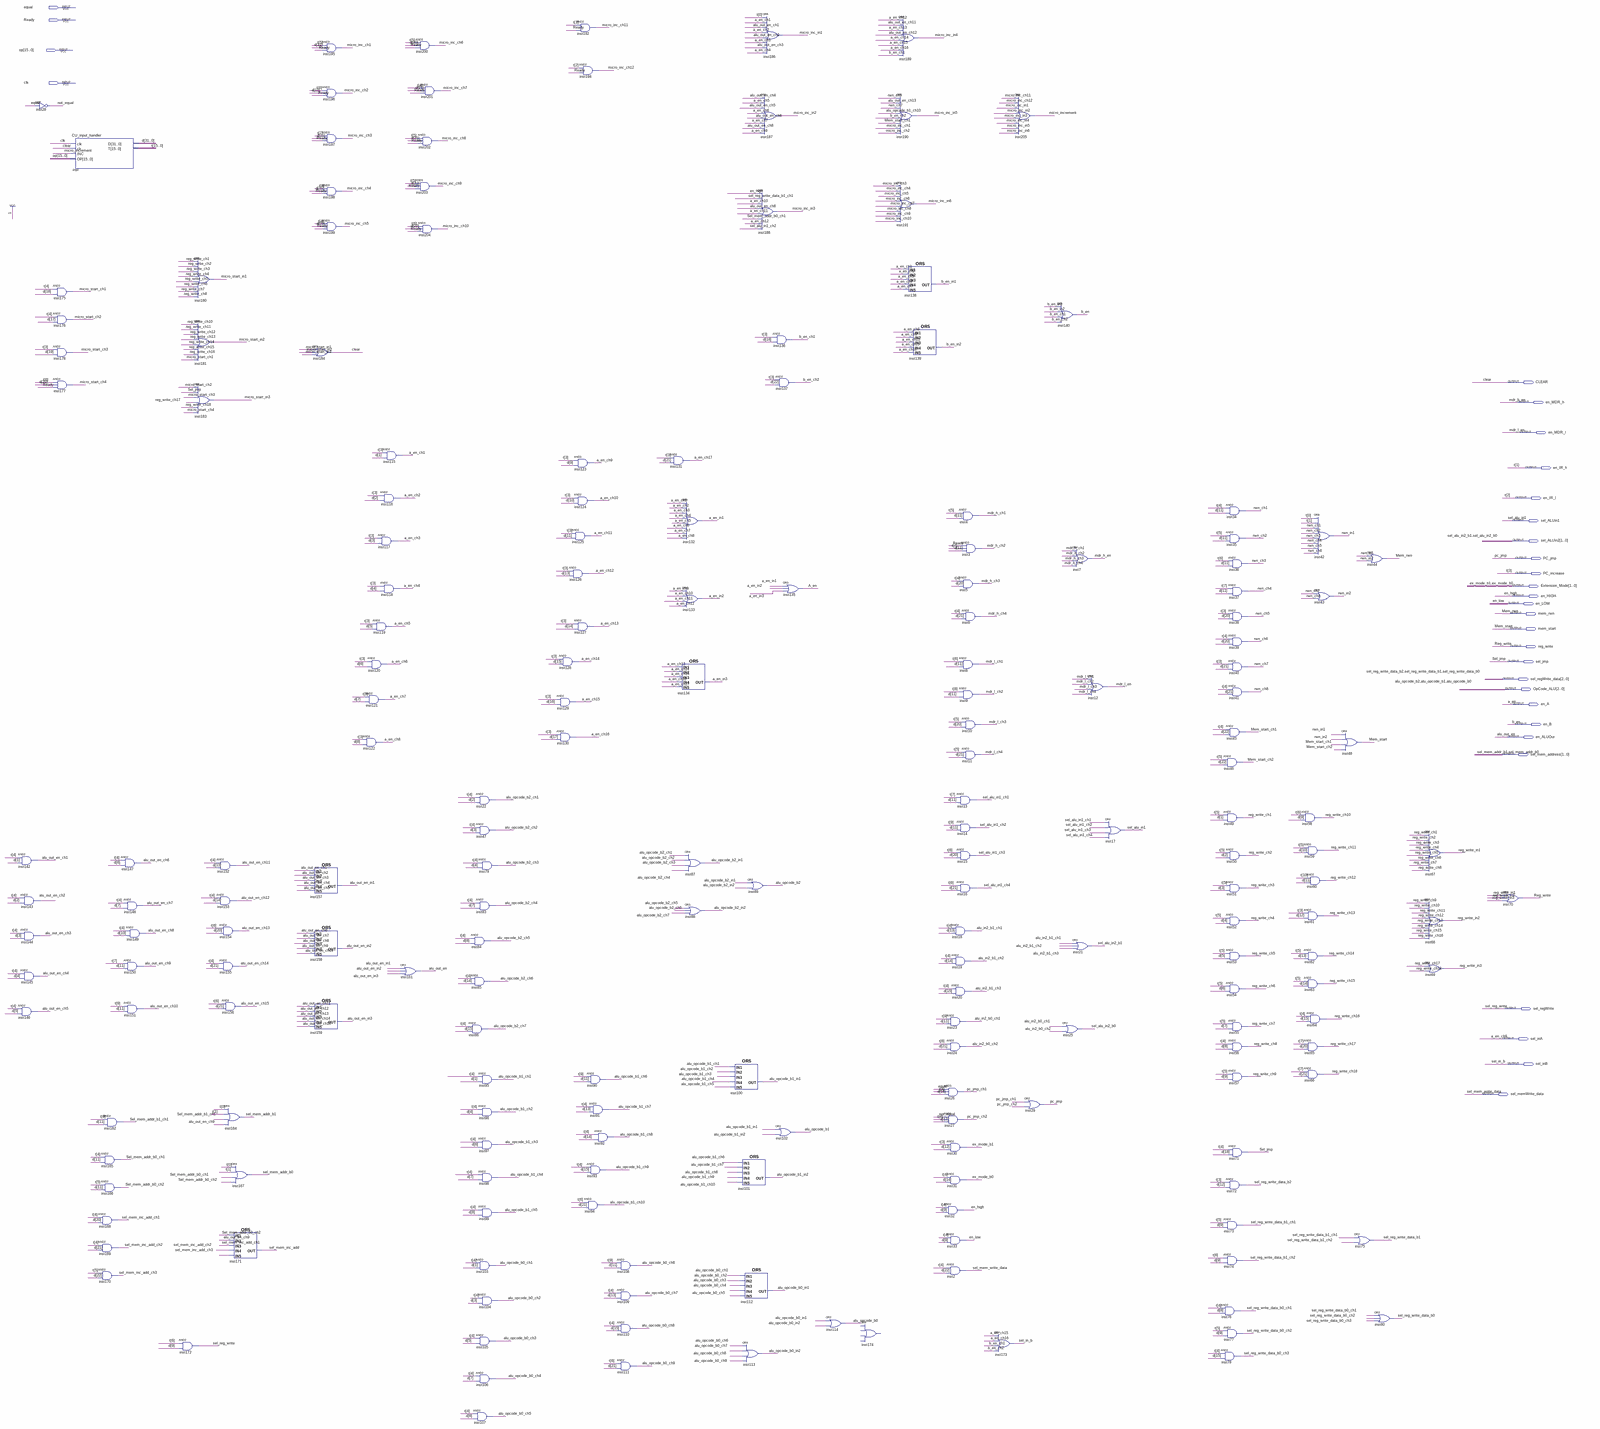
[diagram p0: schematic sheet, whole]
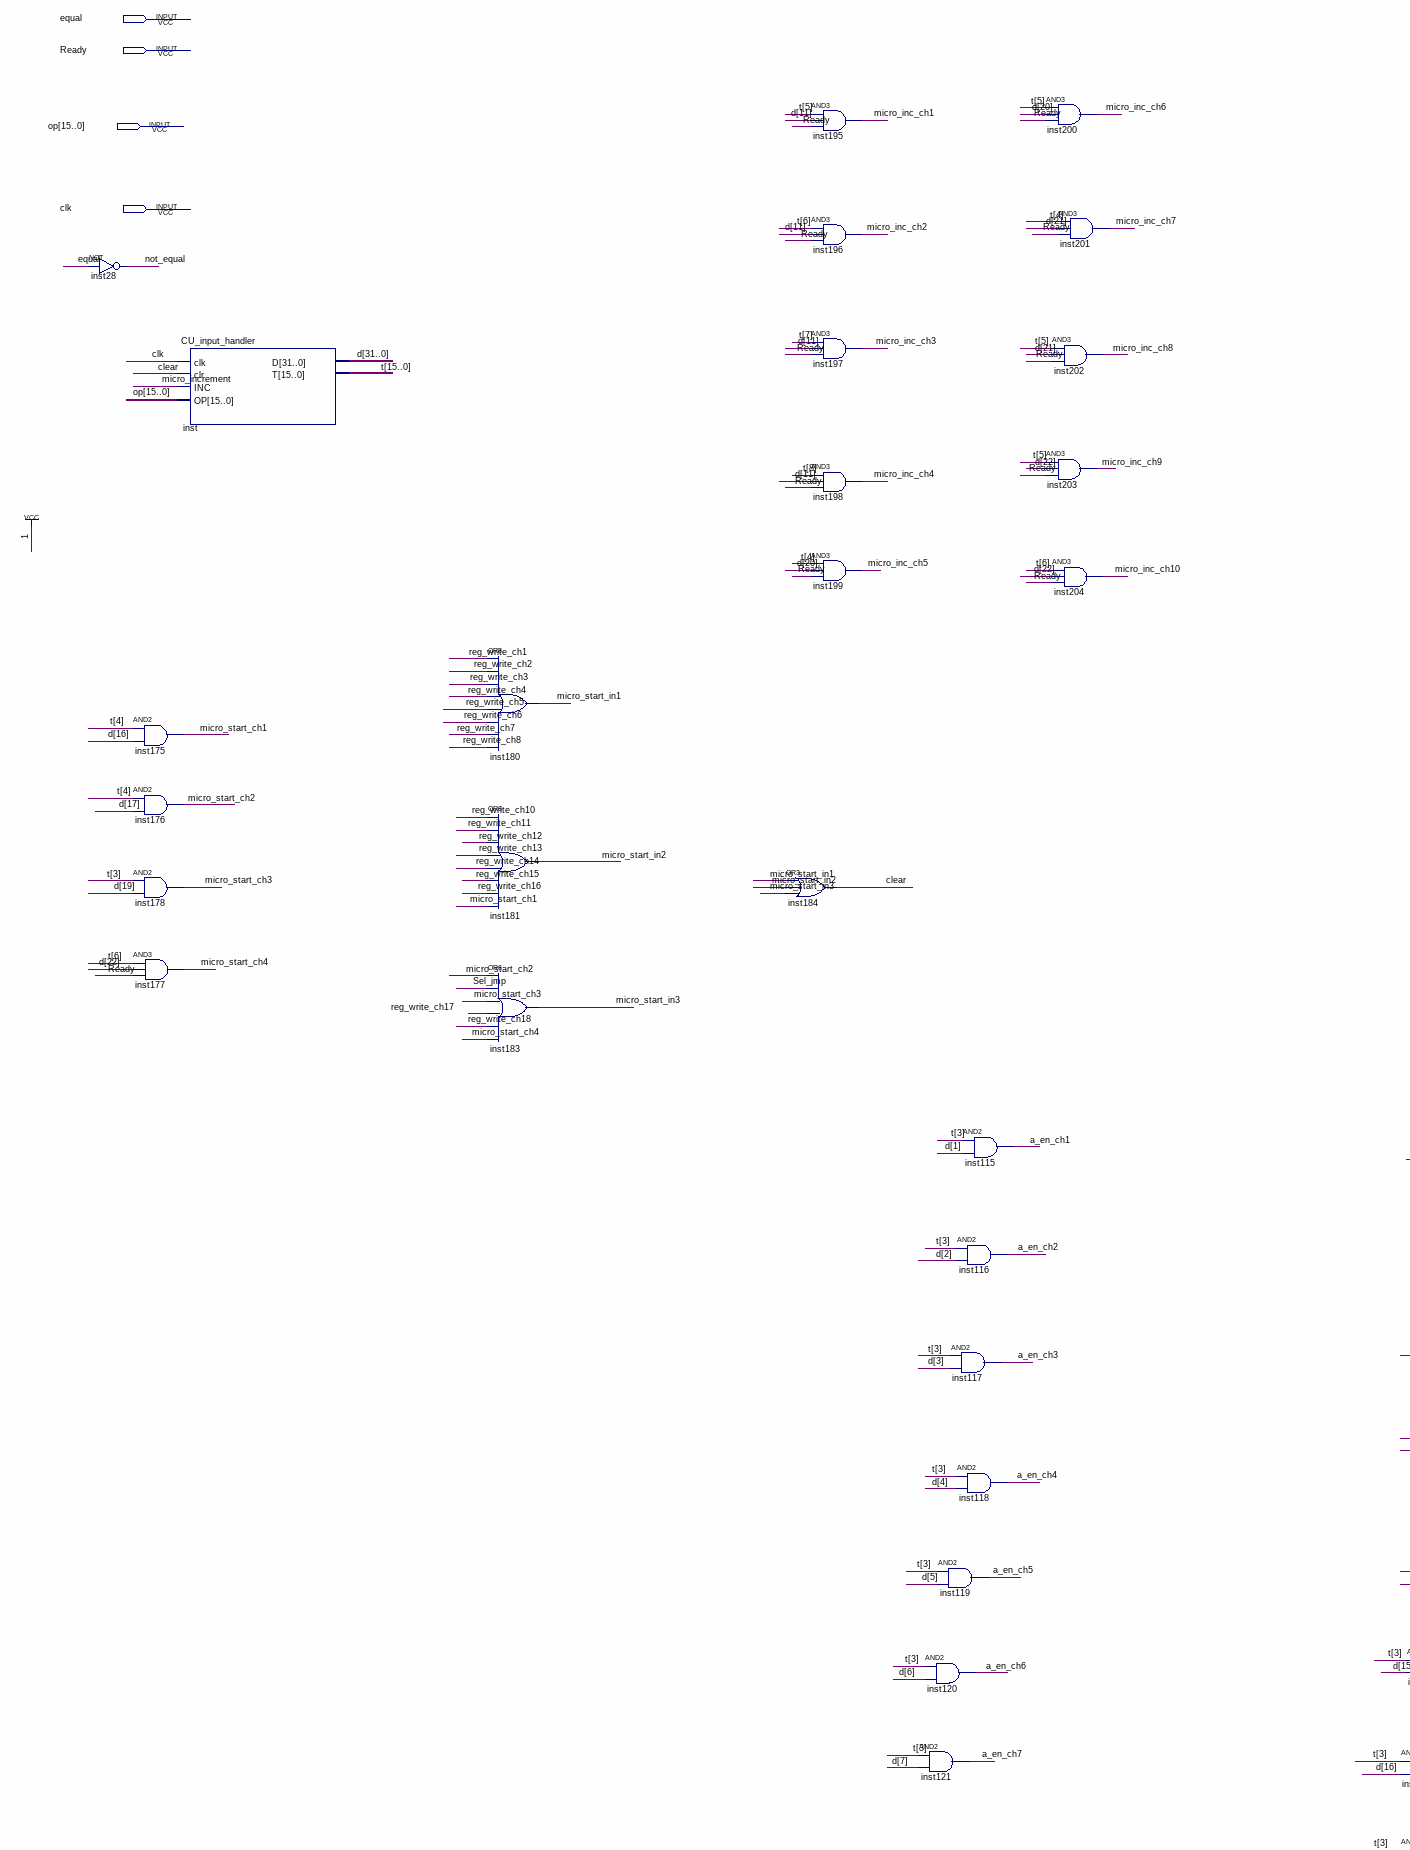
[diagram p1: schematic sheet, upper left part]
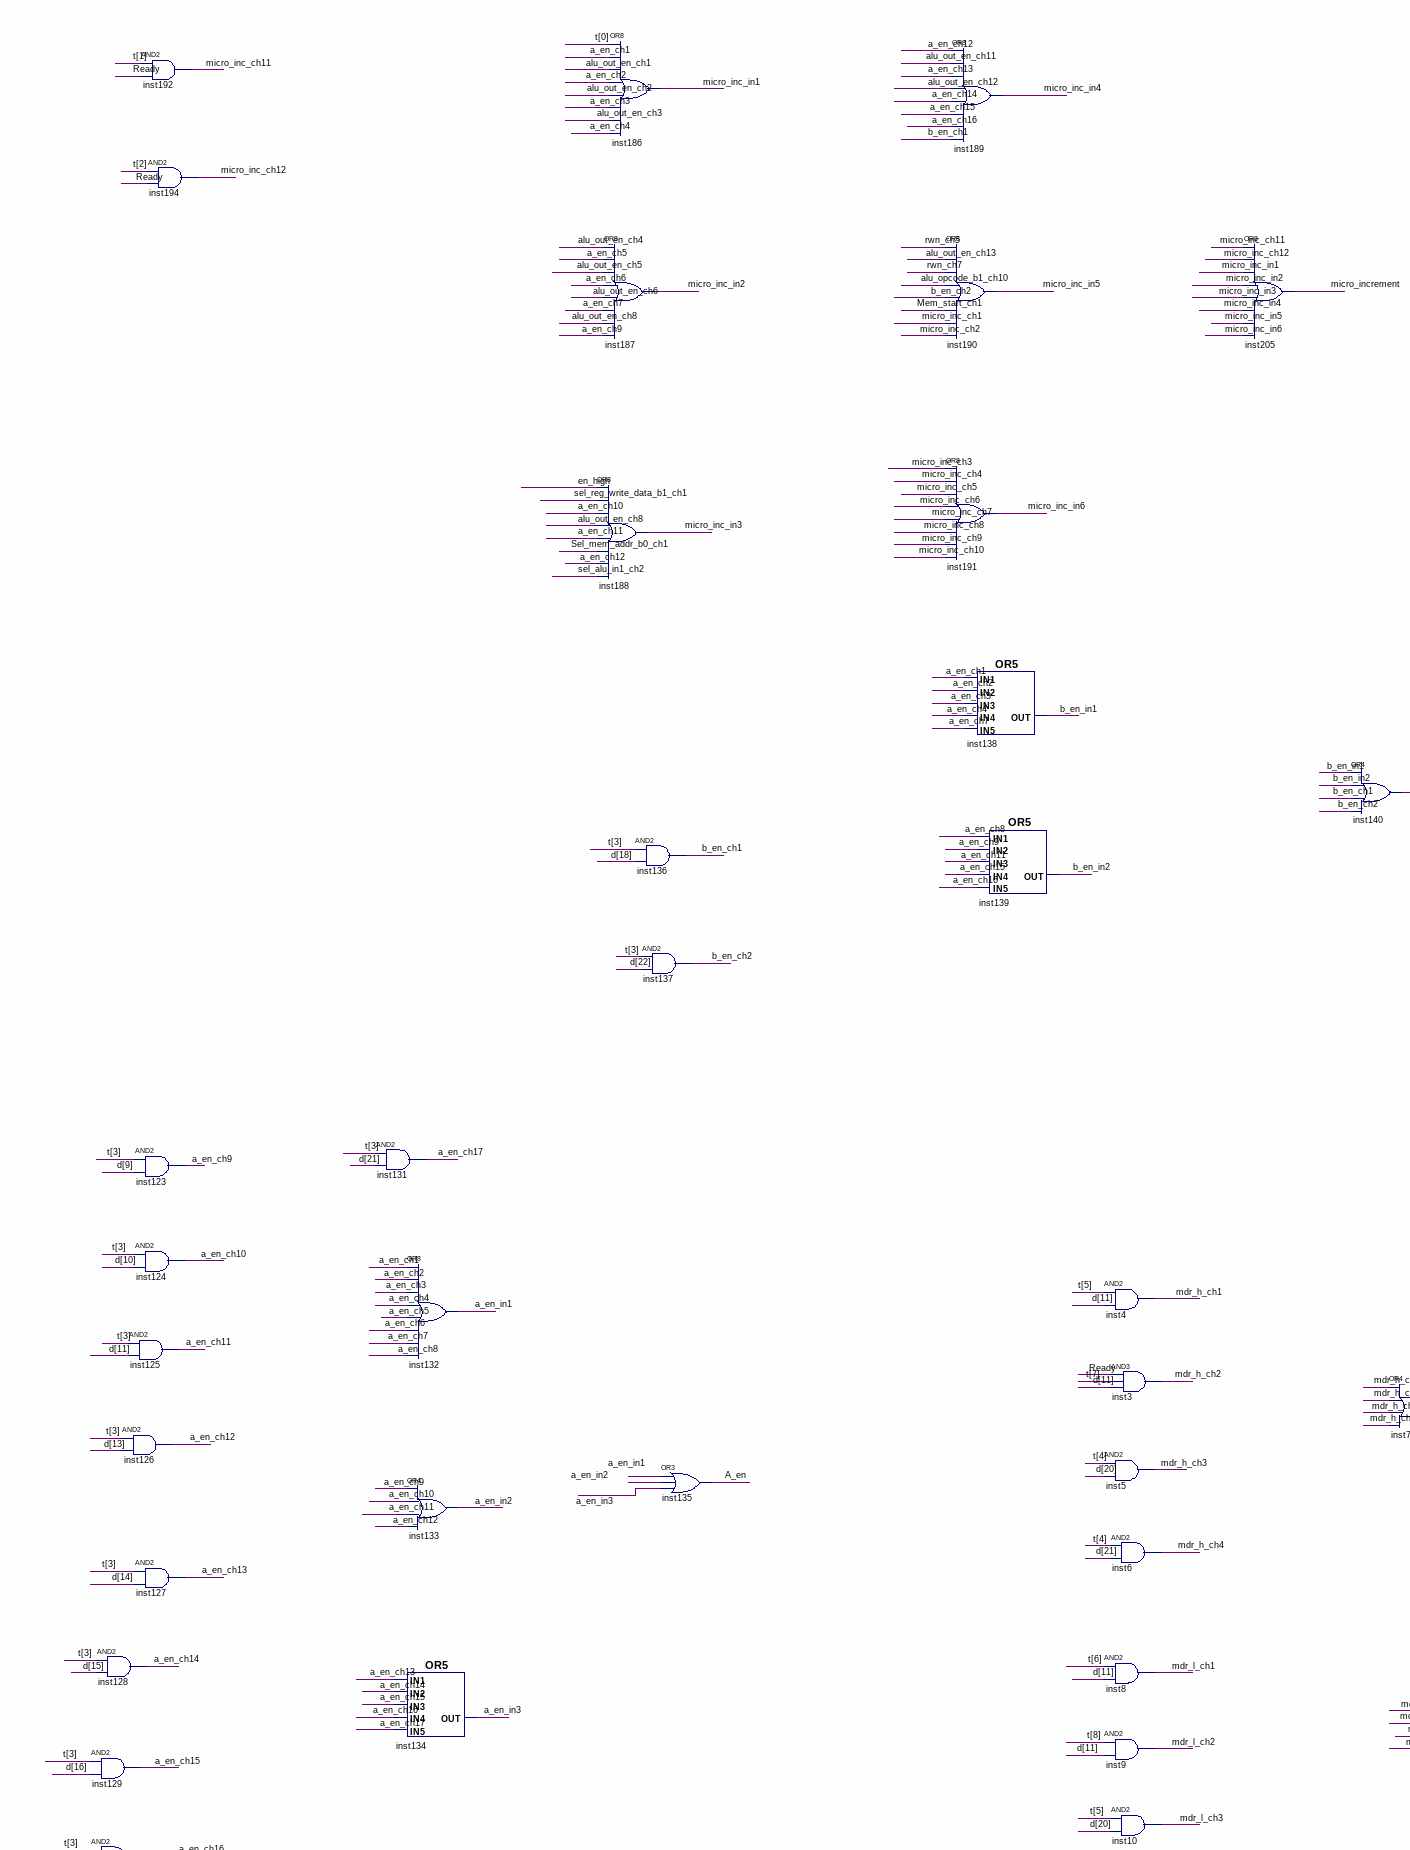
[diagram p2: schematic sheet, upper centre part]
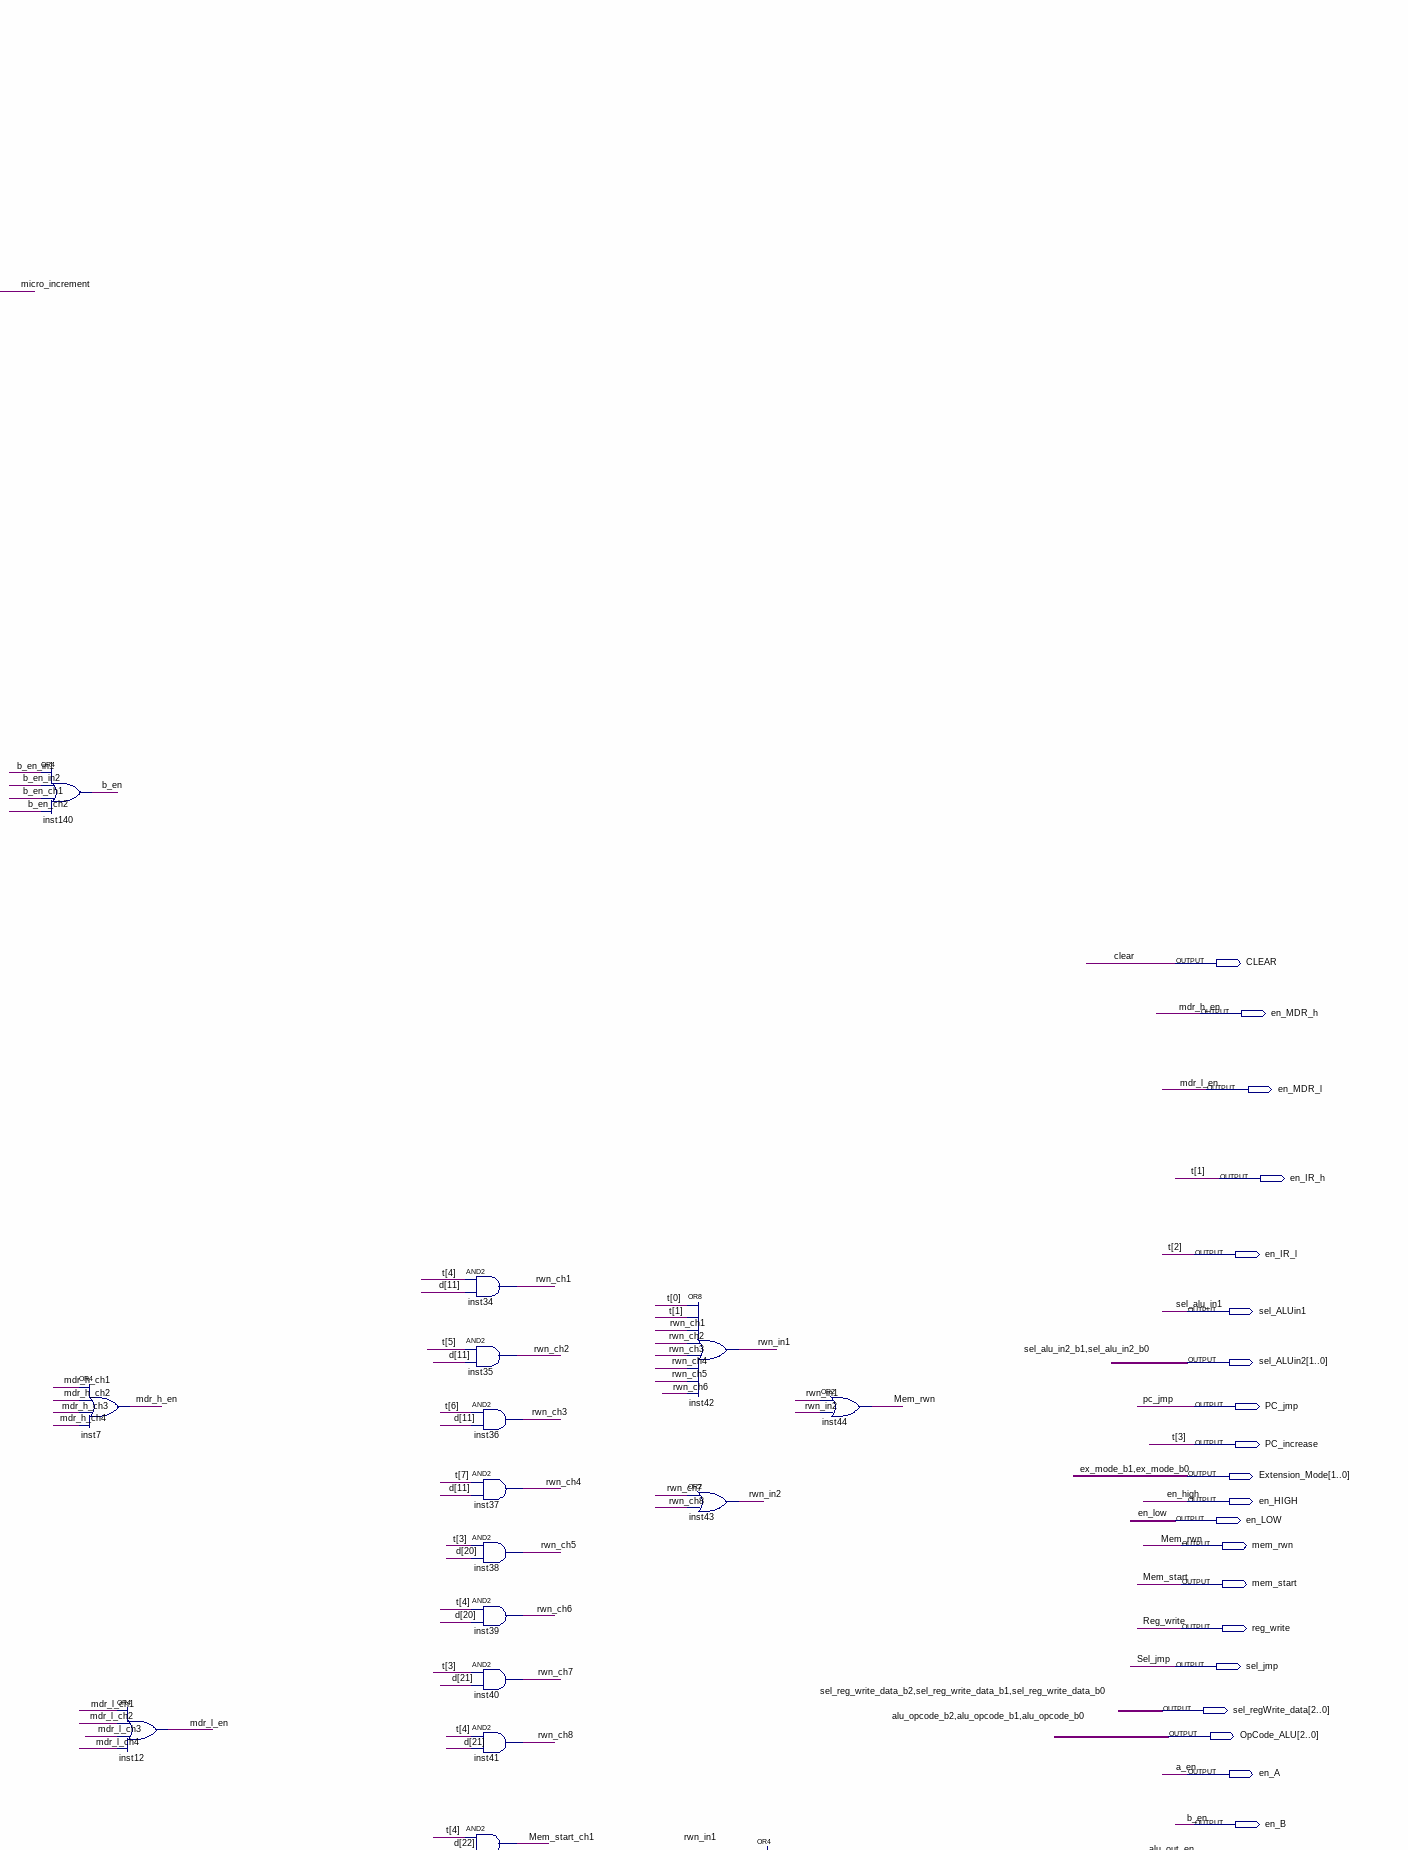
[diagram p3: schematic sheet, upper right part]
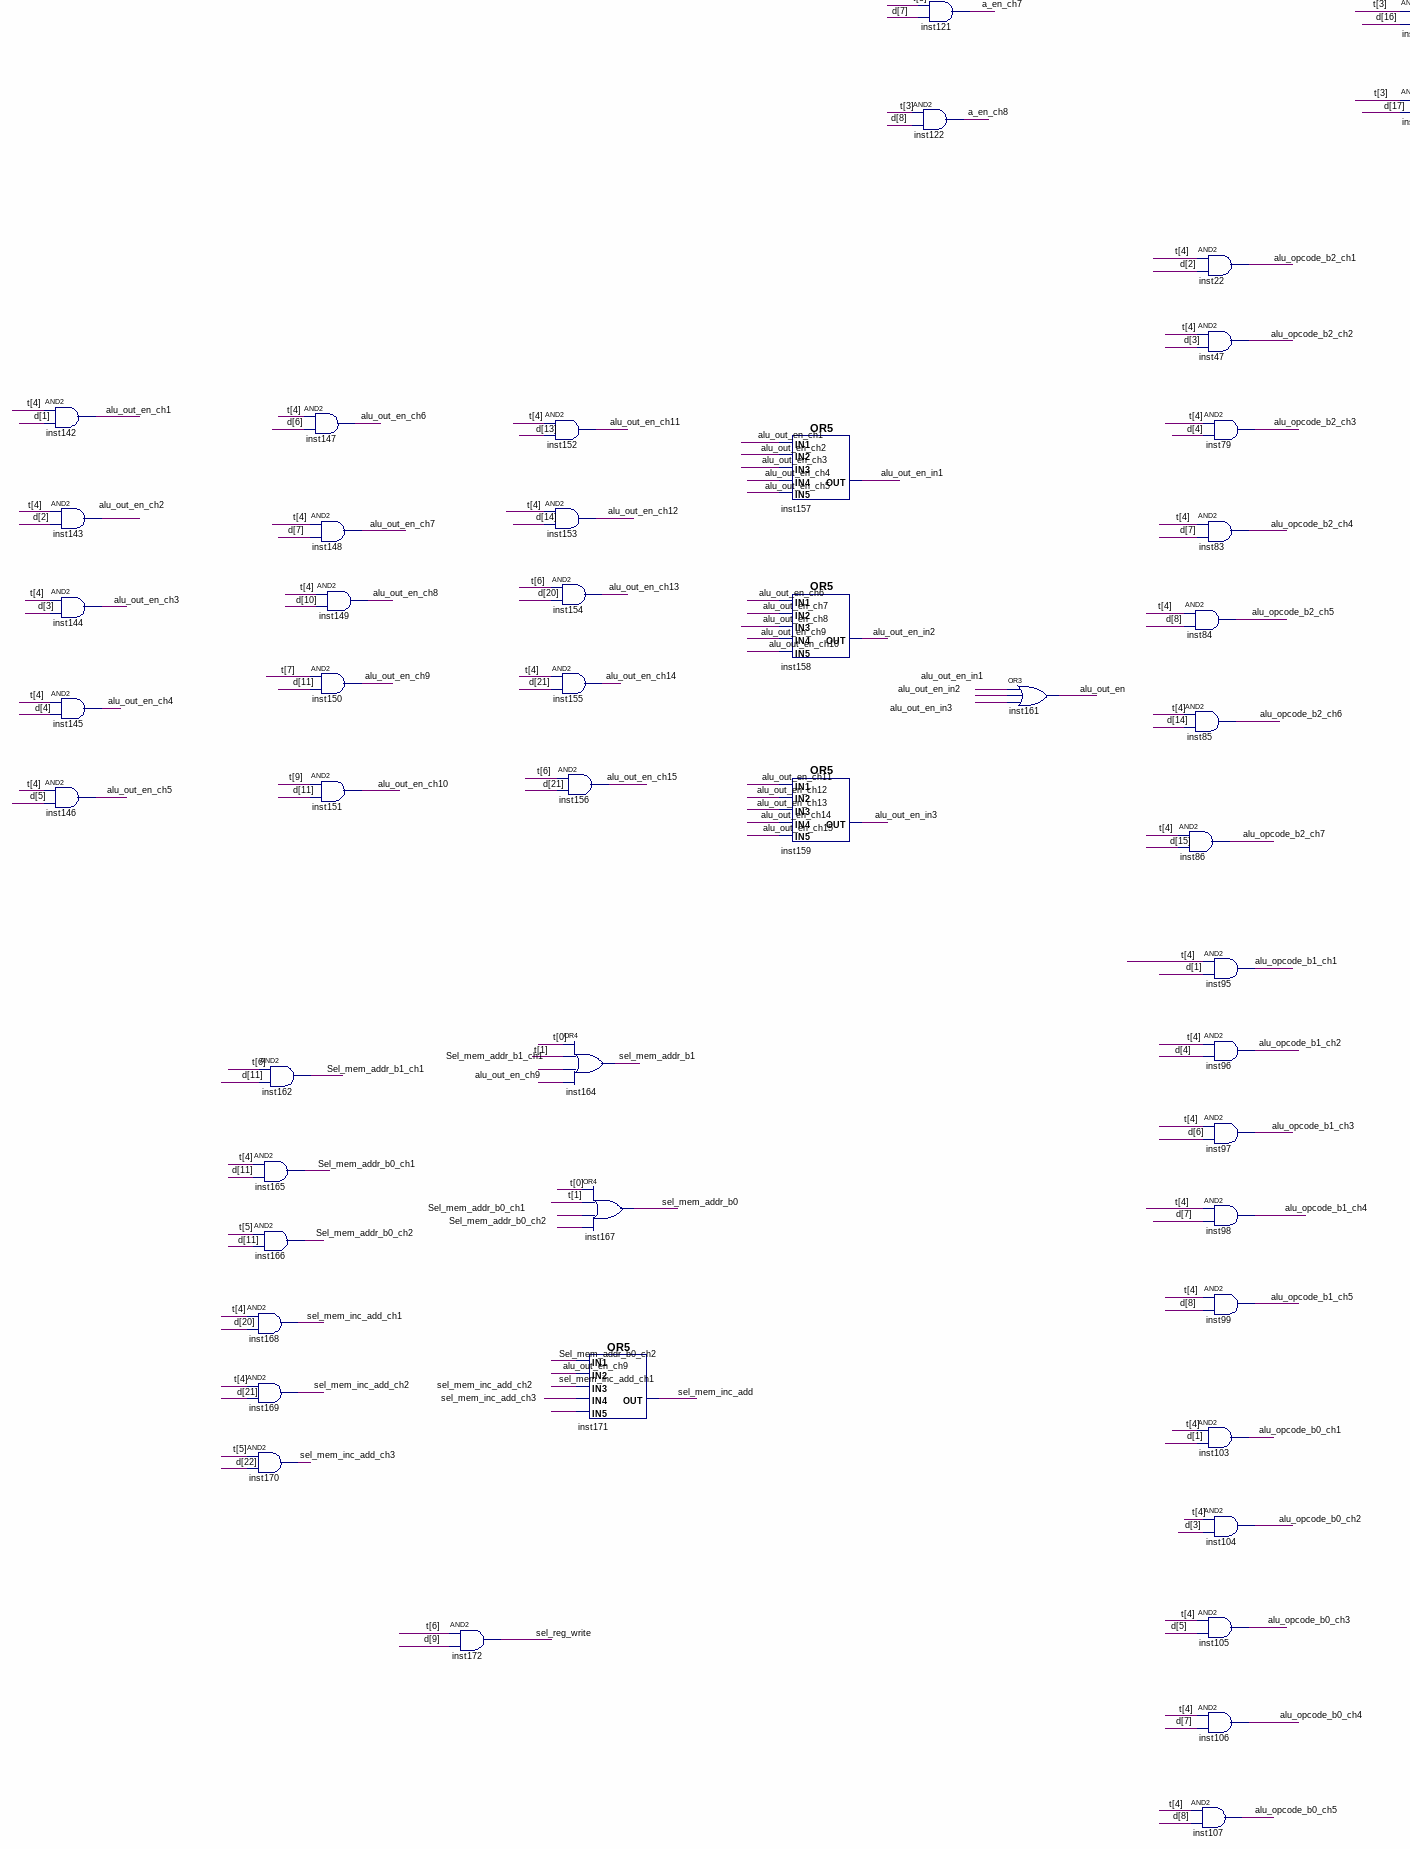
[diagram p4: schematic sheet, lower left part]
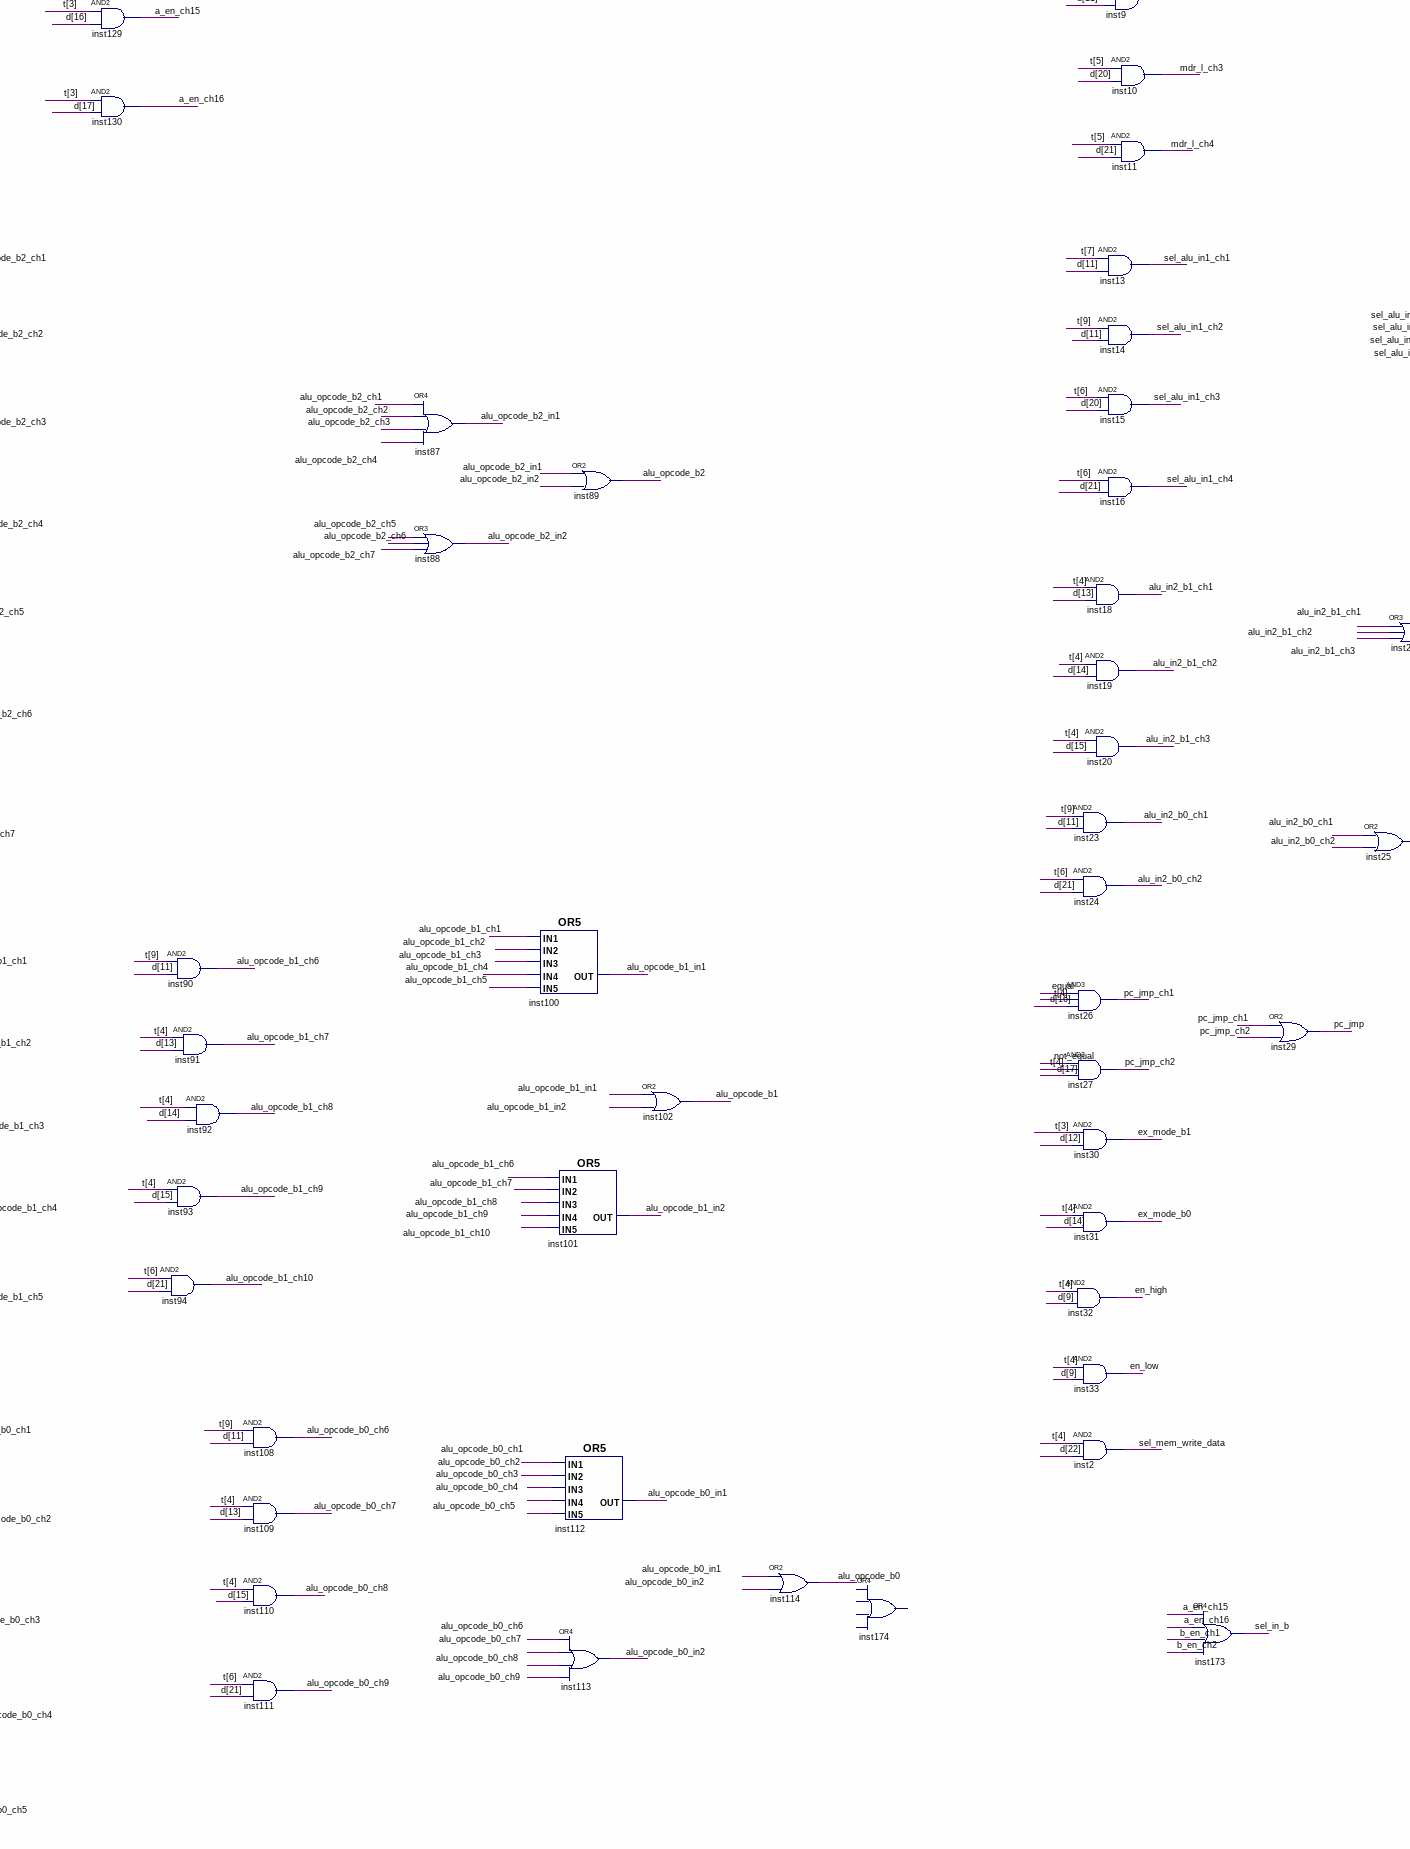
[diagram p5: schematic sheet, lower centre part]
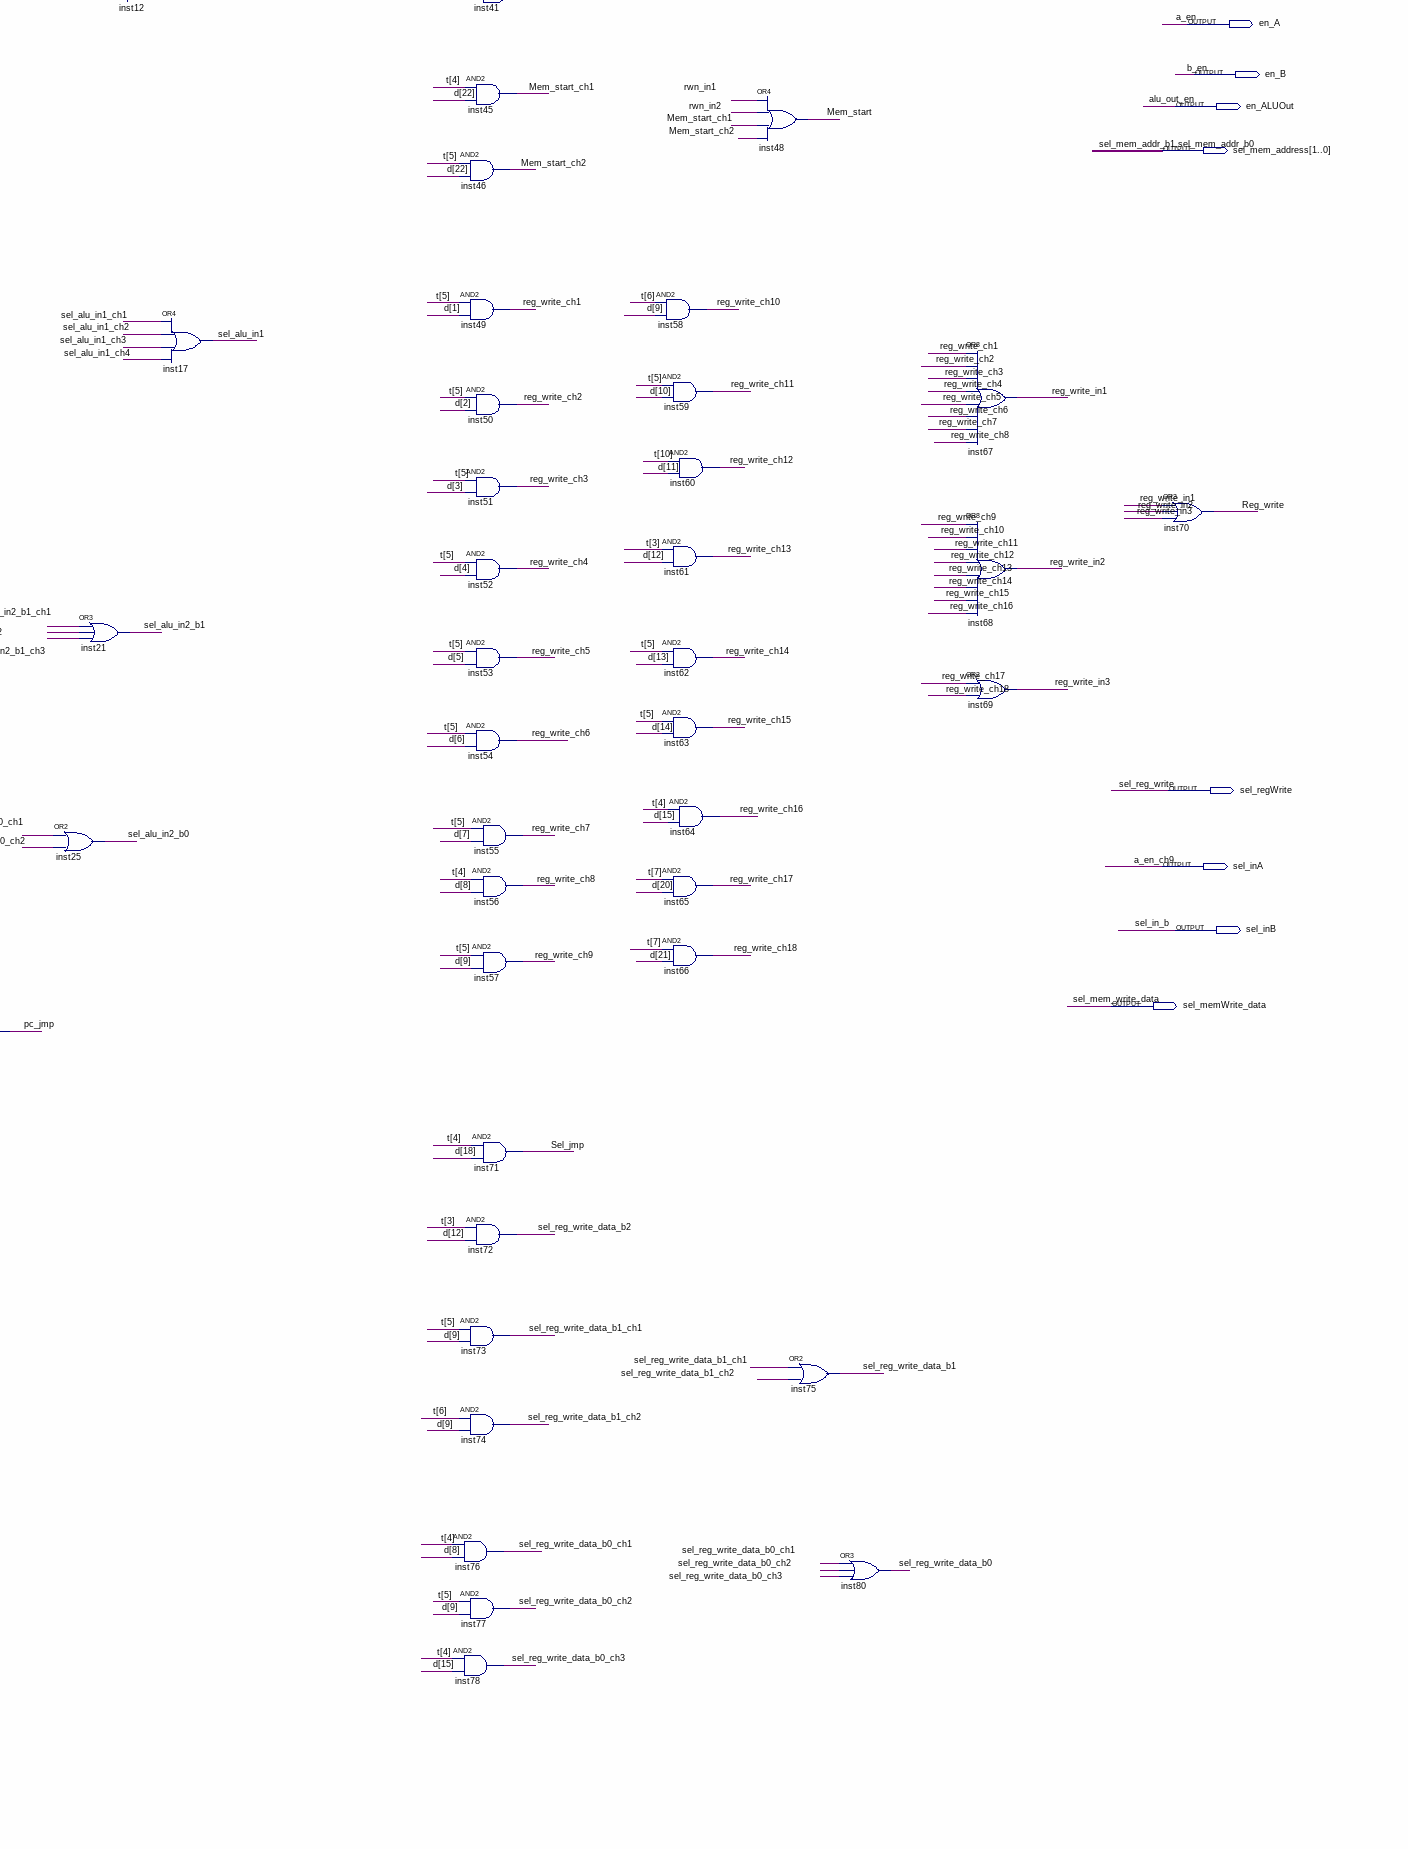
[diagram p6: schematic sheet, lower right part]
// Quartus schematic CU.bdf as structural Verilog: 196 symbols, 30 pins
module CU (
  input  equal,
  input  Ready,
  input  [15:0] op,
  input  clk,
  output CLEAR,
  output en_MDR_h,
  output en_MDR_l,
  output en_IR_h,
  output en_IR_l,
  output sel_ALUin1,
  output [1:0] sel_ALUin2,
  output PC_jmp,
  output PC_increase,
  output [1:0] Extension_Mode,
  output en_HIGH,
  output en_LOW,
  output mem_rwn,
  output mem_start,
  output reg_write,
  output sel_jmp,
  output [2:0] sel_regWrite_data,
  output [2:0] OpCode_ALU,
  output en_A,
  output en_B,
  output en_ALUOut,
  output [1:0] sel_mem_address,
  output sel_regWrite,
  output sel_inA,
  output sel_inB,
  output sel_memWrite_data
);

  wire a_en_ch1, a_en_ch2, a_en_ch3, a_en_ch4, a_en_ch5, a_en_ch6, a_en_ch7, a_en_ch8, a_en_ch10, a_en_ch11,
       a_en_ch12, a_en_ch13, a_en_ch14, a_en_ch15, a_en_ch16, a_en_ch17, a_en_in1, a_en_in2, a_en_in3,
       alu_in2_b0_ch1, alu_in2_b0_ch2, alu_in2_b1_ch1, alu_in2_b1_ch2, alu_in2_b1_ch3, alu_opcode_b0_ch1,
       alu_opcode_b0_ch2, alu_opcode_b0_ch3, alu_opcode_b0_ch4, alu_opcode_b0_ch5, alu_opcode_b0_ch6,
       alu_opcode_b0_ch7, alu_opcode_b0_ch8, alu_opcode_b0_ch9, alu_opcode_b0_in1, alu_opcode_b0_in2,
       alu_opcode_b1_ch1, alu_opcode_b1_ch2, alu_opcode_b1_ch3, alu_opcode_b1_ch4, alu_opcode_b1_ch5,
       alu_opcode_b1_ch6, alu_opcode_b1_ch7, alu_opcode_b1_ch8, alu_opcode_b1_ch9, alu_opcode_b1_ch10,
       alu_opcode_b1_in1, alu_opcode_b1_in2, alu_opcode_b2_ch1, alu_opcode_b2_ch2, alu_opcode_b2_ch3,
       alu_opcode_b2_ch4, alu_opcode_b2_ch5, alu_opcode_b2_ch6, alu_opcode_b2_ch7, alu_opcode_b2_in1,
       alu_opcode_b2_in2, alu_out_en_ch1, alu_out_en_ch2, alu_out_en_ch3, alu_out_en_ch4, alu_out_en_ch5,
       alu_out_en_ch6, alu_out_en_ch7, alu_out_en_ch8, alu_out_en_ch9, alu_out_en_ch10, alu_out_en_ch11,
       alu_out_en_ch12, alu_out_en_ch13, alu_out_en_ch14, alu_out_en_ch15, alu_out_en_in1, alu_out_en_in2,
       alu_out_en_in3, b_en_ch1, b_en_ch2, b_en_in1, b_en_in2, mdr_h_ch1, mdr_h_ch2, mdr_h_ch3, mdr_h_ch4,
       mdr_l_ch1, mdr_l_ch2, mdr_l_ch3, mdr_l_ch4, Mem_start_ch1, Mem_start_ch2, micro_inc_ch1,
       micro_inc_ch2, micro_inc_ch3, micro_inc_ch4, micro_inc_ch5, micro_inc_ch6, micro_inc_ch7,
       micro_inc_ch8, micro_inc_ch9, micro_inc_ch10, micro_inc_ch11, micro_inc_ch12, micro_inc_in1,
       micro_inc_in2, micro_inc_in3, micro_inc_in4, micro_inc_in5, micro_inc_in6, micro_increment,
       micro_start_ch1, micro_start_ch2, micro_start_ch3, micro_start_ch4, micro_start_in1, micro_start_in2,
       micro_start_in3, not_equal, pc_jmp_ch1, pc_jmp_ch2, reg_write_ch1, reg_write_ch2, reg_write_ch3,
       reg_write_ch4, reg_write_ch5, reg_write_ch6, reg_write_ch7, reg_write_ch8, reg_write_ch9,
       reg_write_ch10, reg_write_ch11, reg_write_ch12, reg_write_ch13, reg_write_ch14, reg_write_ch15,
       reg_write_ch16, reg_write_ch17, reg_write_ch18, reg_write_in1, reg_write_in2, reg_write_in3, rwn_ch1,
       rwn_ch2, rwn_ch3, rwn_ch4, rwn_ch5, rwn_ch6, rwn_ch7, rwn_ch8, rwn_in1, rwn_in2, sel_alu_in1_ch1,
       sel_alu_in1_ch2, sel_alu_in1_ch3, sel_alu_in1_ch4, Sel_mem_addr_b0_ch1, Sel_mem_addr_b0_ch2,
       Sel_mem_addr_b1_ch1, sel_mem_inc_add, sel_mem_inc_add_ch1, sel_mem_inc_add_ch2, sel_mem_inc_add_ch3,
       sel_reg_write_data_b0_ch1, sel_reg_write_data_b0_ch2, sel_reg_write_data_b0_ch3,
       sel_reg_write_data_b1_ch1, sel_reg_write_data_b1_ch2;
  wire [15:0] t;
  wire [31:0] d;

  and inst142 (alu_out_en_ch1, t[4], d[1]);
  and inst143 (alu_out_en_ch2, t[4], d[2]);
  and inst144 (alu_out_en_ch3, t[4], d[3]);
  and inst145 (alu_out_en_ch4, t[4], d[4]);
  and inst146 (alu_out_en_ch5, t[4], d[5]);
  not inst28 (not_equal, equal);
  and inst175 (micro_start_ch1, t[4], d[16]);
  and inst176 (micro_start_ch2, t[4], d[17]);
  and inst178 (micro_start_ch3, PC_increase, d[19]);
  and inst177 (micro_start_ch4, t[6], d[22], Ready);
  CU_input_handler inst (
    .clk(clk), .clr(CLEAR), .INC(micro_increment), .OP(op), .D(d),
    .T({t[15:4], PC_increase, en_IR_l, en_IR_h, t[0]}));
  and inst162 (Sel_mem_addr_b1_ch1, t[6], d[11]);
  and inst165 (Sel_mem_addr_b0_ch1, t[4], d[11]);
  and inst166 (Sel_mem_addr_b0_ch2, t[5], d[11]);
  and inst168 (sel_mem_inc_add_ch1, t[4], d[20]);
  and inst169 (sel_mem_inc_add_ch2, t[4], d[21]);
  and inst170 (sel_mem_inc_add_ch3, t[5], d[22]);
  and inst147 (alu_out_en_ch6, t[4], d[6]);
  and inst148 (alu_out_en_ch7, t[4], d[7]);
  and inst149 (alu_out_en_ch8, t[4], d[10]);
  and inst150 (alu_out_en_ch9, t[7], d[11]);
  and inst151 (alu_out_en_ch10, t[9], d[11]);
  and inst172 (sel_regWrite, t[6], d[9]);
  or inst180 (micro_start_in1, reg_write_ch1, reg_write_ch2, reg_write_ch3, reg_write_ch4, reg_write_ch5, reg_write_ch6, reg_write_ch7, reg_write_ch8);
  or inst181 (micro_start_in2, reg_write_ch10, reg_write_ch11, reg_write_ch12, reg_write_ch13, reg_write_ch14, reg_write_ch15, reg_write_ch16, micro_start_ch1);
  or inst183 (micro_start_in3, micro_start_ch2, sel_jmp, micro_start_ch3, reg_write_ch17, reg_write_ch18, micro_start_ch4);
  and inst152 (alu_out_en_ch11, t[4], d[13]);
  and inst153 (alu_out_en_ch12, t[4], d[14]);
  and inst154 (alu_out_en_ch13, t[6], d[20]);
  and inst155 (alu_out_en_ch14, t[4], d[21]);
  and inst156 (alu_out_en_ch15, t[6], d[21]);
  or inst164 (sel_mem_address[1], t[0], en_IR_h, Sel_mem_addr_b1_ch1, alu_out_en_ch9);
  or inst171 (sel_mem_inc_add, Sel_mem_addr_b0_ch2, alu_out_en_ch9, sel_mem_inc_add_ch1, sel_mem_inc_add_ch2, sel_mem_inc_add_ch3);
  or inst167 (sel_mem_address[0], t[0], en_IR_h, Sel_mem_addr_b0_ch1, Sel_mem_addr_b0_ch2);
  or inst157 (alu_out_en_in1, alu_out_en_ch1, alu_out_en_ch2, alu_out_en_ch3, alu_out_en_ch4, alu_out_en_ch5);
  or inst158 (alu_out_en_in2, alu_out_en_ch6, alu_out_en_ch7, alu_out_en_ch8, alu_out_en_ch9, alu_out_en_ch10);
  or inst159 (alu_out_en_in3, alu_out_en_ch11, alu_out_en_ch12, alu_out_en_ch13, alu_out_en_ch14, alu_out_en_ch15);
  and inst195 (micro_inc_ch1, t[5], d[11], Ready);
  and inst196 (micro_inc_ch2, t[6], d[11], Ready);
  and inst197 (micro_inc_ch3, t[7], d[11], Ready);
  and inst198 (micro_inc_ch4, t[8], d[11], Ready);
  and inst199 (micro_inc_ch5, t[4], d[20], Ready);
  or inst184 (CLEAR, micro_start_in1, micro_start_in2, micro_start_in3);
  and inst120 (a_en_ch6, PC_increase, d[6]);
  and inst121 (a_en_ch7, PC_increase, d[7]);
  and inst122 (a_en_ch8, PC_increase, d[8]);
  and inst115 (a_en_ch1, PC_increase, d[1]);
  and inst116 (a_en_ch2, PC_increase, d[2]);
  and inst117 (a_en_ch3, PC_increase, d[3]);
  and inst118 (a_en_ch4, PC_increase, d[4]);
  and inst119 (a_en_ch5, PC_increase, d[5]);
  or inst161 (en_ALUOut, alu_out_en_in1, alu_out_en_in2, alu_out_en_in3);
  and inst200 (micro_inc_ch6, t[5], d[20], Ready);
  and inst201 (micro_inc_ch7, t[4], d[21], Ready);
  and inst202 (micro_inc_ch8, t[5], d[21], Ready);
  and inst203 (micro_inc_ch9, t[5], d[22], Ready);
  and inst204 (micro_inc_ch10, t[6], d[22], Ready);
  and inst84 (alu_opcode_b2_ch5, t[4], d[8]);
  and inst85 (alu_opcode_b2_ch6, t[4], d[14]);
  and inst86 (alu_opcode_b2_ch7, t[4], d[15]);
  and inst22 (alu_opcode_b2_ch1, t[4], d[2]);
  and inst47 (alu_opcode_b2_ch2, t[4], d[3]);
  and inst79 (alu_opcode_b2_ch3, t[4], d[4]);
  and inst83 (alu_opcode_b2_ch4, t[4], d[7]);
  and inst95 (alu_opcode_b1_ch1, t[4], d[1]);
  and inst96 (alu_opcode_b1_ch2, t[4], d[4]);
  and inst97 (alu_opcode_b1_ch3, t[4], d[6]);
  and inst98 (alu_opcode_b1_ch4, t[4], d[7]);
  and inst99 (alu_opcode_b1_ch5, t[4], d[8]);
  and inst103 (alu_opcode_b0_ch1, t[4], d[1]);
  and inst104 (alu_opcode_b0_ch2, t[4], d[3]);
  and inst105 (alu_opcode_b0_ch3, t[4], d[5]);
  and inst106 (alu_opcode_b0_ch4, t[4], d[7]);
  and inst107 (alu_opcode_b0_ch5, t[4], d[8]);
  and inst125 (a_en_ch11, PC_increase, d[11]);
  and inst126 (a_en_ch12, PC_increase, d[13]);
  and inst128 (a_en_ch14, PC_increase, d[15]);
  and inst129 (a_en_ch15, PC_increase, d[16]);
  and inst130 (a_en_ch16, PC_increase, d[17]);
  and inst192 (micro_inc_ch11, en_IR_h, Ready);
  and inst194 (micro_inc_ch12, en_IR_l, Ready);
  and inst123 (sel_inA, PC_increase, d[9]);
  and inst124 (a_en_ch10, PC_increase, d[10]);
  and inst127 (a_en_ch13, PC_increase, d[14]);
  and inst90 (alu_opcode_b1_ch6, t[9], d[11]);
  and inst91 (alu_opcode_b1_ch7, t[4], d[13]);
  and inst93 (alu_opcode_b1_ch9, t[4], d[15]);
  and inst94 (alu_opcode_b1_ch10, t[6], d[21]);
  and inst92 (alu_opcode_b1_ch8, t[4], d[14]);
  and inst108 (alu_opcode_b0_ch6, t[9], d[11]);
  and inst109 (alu_opcode_b0_ch7, t[4], d[13]);
  and inst110 (alu_opcode_b0_ch8, t[4], d[15]);
  and inst111 (alu_opcode_b0_ch9, t[6], d[21]);
  and inst131 (a_en_ch17, PC_increase, d[21]);
  or inst132 (a_en_in1, a_en_ch1, a_en_ch2, a_en_ch3, a_en_ch4, a_en_ch5, a_en_ch6, a_en_ch7, a_en_ch8);
  or inst133 (a_en_in2, sel_inA, a_en_ch10, a_en_ch11, a_en_ch12);
  or inst134 (a_en_in3, a_en_ch13, a_en_ch14, a_en_ch15, a_en_ch16, a_en_ch17);
  or inst87 (alu_opcode_b2_in1, alu_opcode_b2_ch1, alu_opcode_b2_ch2, alu_opcode_b2_ch3, alu_opcode_b2_ch4);
  or inst88 (alu_opcode_b2_in2, alu_opcode_b2_ch5, alu_opcode_b2_ch6, alu_opcode_b2_ch7);
  or inst100 (alu_opcode_b1_in1, alu_opcode_b1_ch1, alu_opcode_b1_ch2, alu_opcode_b1_ch3, alu_opcode_b1_ch4, alu_opcode_b1_ch5);
  or inst89 (OpCode_ALU[2], alu_opcode_b2_in1, alu_opcode_b2_in2);
  or inst101 (alu_opcode_b1_in2, alu_opcode_b1_ch6, alu_opcode_b1_ch7, alu_opcode_b1_ch8, alu_opcode_b1_ch9, alu_opcode_b1_ch10);
  or inst112 (alu_opcode_b0_in1, alu_opcode_b0_ch1, alu_opcode_b0_ch2, alu_opcode_b0_ch3, alu_opcode_b0_ch4, alu_opcode_b0_ch5);
  or inst113 (alu_opcode_b0_in2, alu_opcode_b0_ch6, alu_opcode_b0_ch7, alu_opcode_b0_ch8, alu_opcode_b0_ch9);
  or inst186 (micro_inc_in1, t[0], a_en_ch1, alu_out_en_ch1, a_en_ch2, alu_out_en_ch2, a_en_ch3, alu_out_en_ch3, a_en_ch4);
  or inst187 (micro_inc_in2, alu_out_en_ch4, a_en_ch5, alu_out_en_ch5, a_en_ch6, alu_out_en_ch6, a_en_ch7, alu_out_en_ch8, sel_inA);
  or inst188 (micro_inc_in3, en_HIGH, sel_reg_write_data_b1_ch1, a_en_ch10, alu_out_en_ch8, a_en_ch11, Sel_mem_addr_b0_ch1, a_en_ch12, sel_alu_in1_ch2);
  and inst136 (b_en_ch1, PC_increase, d[18]);
  and inst137 (b_en_ch2, PC_increase, d[22]);
  or inst135 (en_A, a_en_in1, a_en_in2, a_en_in3);
  or inst102 (OpCode_ALU[1], alu_opcode_b1_in1, alu_opcode_b1_in2);
  or inst114 (OpCode_ALU[0], alu_opcode_b0_in1, alu_opcode_b0_in2);
  // OR4 inst174 is placed but not wired
  or inst189 (micro_inc_in4, a_en_ch12, alu_out_en_ch11, a_en_ch13, alu_out_en_ch12, a_en_ch14, a_en_ch15, a_en_ch16, b_en_ch1);
  or inst190 (micro_inc_in5, rwn_ch5, alu_out_en_ch13, rwn_ch7, alu_opcode_b1_ch10, b_en_ch2, Mem_start_ch1, micro_inc_ch1, micro_inc_ch2);
  or inst191 (micro_inc_in6, micro_inc_ch3, micro_inc_ch4, micro_inc_ch5, micro_inc_ch6, micro_inc_ch7, micro_inc_ch8, micro_inc_ch9, micro_inc_ch10);
  or inst138 (b_en_in1, a_en_ch1, a_en_ch2, a_en_ch3, a_en_ch4, a_en_ch7);
  or inst139 (b_en_in2, a_en_ch8, sel_inA, a_en_ch11, a_en_ch15, a_en_ch16);
  and inst18 (alu_in2_b1_ch1, t[4], d[13]);
  and inst19 (alu_in2_b1_ch2, t[4], d[14]);
  and inst20 (alu_in2_b1_ch3, t[4], d[15]);
  and inst23 (alu_in2_b0_ch1, t[9], d[11]);
  and inst24 (alu_in2_b0_ch2, t[6], d[21]);
  and inst26 (pc_jmp_ch1, equal, t[4], d[16]);
  and inst27 (pc_jmp_ch2, not_equal, t[4], d[17]);
  and inst30 (Extension_Mode[1], PC_increase, d[12]);
  and inst31 (Extension_Mode[0], t[4], d[14]);
  and inst32 (en_HIGH, t[4], d[9]);
  and inst33 (en_LOW, t[4], d[9]);
  and inst2 (sel_memWrite_data, t[4], d[22]);
  and inst4 (mdr_h_ch1, t[5], d[11]);
  and inst3 (mdr_h_ch2, Ready, t[7], d[11]);
  and inst5 (mdr_h_ch3, t[4], d[20]);
  and inst6 (mdr_h_ch4, t[4], d[21]);
  and inst8 (mdr_l_ch1, t[6], d[11]);
  and inst9 (mdr_l_ch2, t[8], d[11]);
  and inst10 (mdr_l_ch3, t[5], d[20]);
  and inst11 (mdr_l_ch4, t[5], d[21]);
  and inst13 (sel_alu_in1_ch1, t[7], d[11]);
  and inst14 (sel_alu_in1_ch2, t[9], d[11]);
  and inst15 (sel_alu_in1_ch3, t[6], d[20]);
  and inst16 (sel_alu_in1_ch4, t[6], d[21]);
  or inst173 (sel_inB, a_en_ch15, a_en_ch16, b_en_ch1, b_en_ch2);
  or inst205 (micro_increment, micro_inc_ch11, micro_inc_ch12, micro_inc_in1, micro_inc_in2, micro_inc_in3, micro_inc_in4, micro_inc_in5, micro_inc_in6);
  or inst29 (PC_jmp, pc_jmp_ch1, pc_jmp_ch2);
  or inst140 (en_B, b_en_in1, b_en_in2, b_en_ch1, b_en_ch2);
  or inst7 (en_MDR_h, mdr_h_ch1, mdr_h_ch2, mdr_h_ch3, mdr_h_ch4);
  or inst21 (sel_ALUin2[1], alu_in2_b1_ch1, alu_in2_b1_ch2, alu_in2_b1_ch3);
  or inst25 (sel_ALUin2[0], alu_in2_b0_ch1, alu_in2_b0_ch2);
  or inst12 (en_MDR_l, mdr_l_ch1, mdr_l_ch2, mdr_l_ch3, mdr_l_ch4);
  or inst17 (sel_ALUin1, sel_alu_in1_ch1, sel_alu_in1_ch2, sel_alu_in1_ch3, sel_alu_in1_ch4);
  and inst34 (rwn_ch1, t[4], d[11]);
  and inst35 (rwn_ch2, t[5], d[11]);
  and inst36 (rwn_ch3, t[6], d[11]);
  and inst37 (rwn_ch4, t[7], d[11]);
  and inst38 (rwn_ch5, PC_increase, d[20]);
  and inst39 (rwn_ch6, t[4], d[20]);
  and inst40 (rwn_ch7, PC_increase, d[21]);
  and inst41 (rwn_ch8, t[4], d[21]);
  and inst45 (Mem_start_ch1, t[4], d[22]);
  and inst46 (Mem_start_ch2, t[5], d[22]);
  and inst49 (reg_write_ch1, t[5], d[1]);
  and inst50 (reg_write_ch2, t[5], d[2]);
  and inst51 (reg_write_ch3, t[5], d[3]);
  and inst52 (reg_write_ch4, t[5], d[4]);
  and inst53 (reg_write_ch5, t[5], d[5]);
  and inst54 (reg_write_ch6, t[5], d[6]);
  and inst55 (reg_write_ch7, t[5], d[7]);
  and inst56 (reg_write_ch8, t[4], d[8]);
  and inst57 (reg_write_ch9, t[5], d[9]);
  and inst71 (sel_jmp, t[4], d[18]);
  and inst72 (sel_regWrite_data[2], PC_increase, d[12]);
  and inst73 (sel_reg_write_data_b1_ch1, t[5], d[9]);
  and inst74 (sel_reg_write_data_b1_ch2, t[6], d[9]);
  and inst76 (sel_reg_write_data_b0_ch1, t[4], d[8]);
  and inst77 (sel_reg_write_data_b0_ch2, t[5], d[9]);
  and inst78 (sel_reg_write_data_b0_ch3, t[4], d[15]);
  or inst42 (rwn_in1, t[0], en_IR_h, rwn_ch1, rwn_ch2, rwn_ch3, rwn_ch4, rwn_ch5, rwn_ch6);
  or inst43 (rwn_in2, rwn_ch7, rwn_ch8);
  and inst58 (reg_write_ch10, t[6], d[9]);
  and inst59 (reg_write_ch11, t[5], d[10]);
  and inst60 (reg_write_ch12, t[10], d[11]);
  and inst61 (reg_write_ch13, PC_increase, d[12]);
  and inst62 (reg_write_ch14, t[5], d[13]);
  and inst63 (reg_write_ch15, t[5], d[14]);
  and inst64 (reg_write_ch16, t[4], d[15]);
  and inst65 (reg_write_ch17, t[7], d[20]);
  and inst66 (reg_write_ch18, t[7], d[21]);
  or inst48 (mem_start, rwn_in1, rwn_in2, Mem_start_ch1, Mem_start_ch2);
  or inst75 (sel_regWrite_data[1], sel_reg_write_data_b1_ch1, sel_reg_write_data_b1_ch2);
  or inst44 (mem_rwn, rwn_in1, rwn_in2);
  or inst80 (sel_regWrite_data[0], sel_reg_write_data_b0_ch1, sel_reg_write_data_b0_ch2, sel_reg_write_data_b0_ch3);
  or inst67 (reg_write_in1, reg_write_ch1, reg_write_ch2, reg_write_ch3, reg_write_ch4, reg_write_ch5, reg_write_ch6, reg_write_ch7, reg_write_ch8);
  or inst68 (reg_write_in2, reg_write_ch9, reg_write_ch10, reg_write_ch11, reg_write_ch12, reg_write_ch13, reg_write_ch14, reg_write_ch15, reg_write_ch16);
  or inst69 (reg_write_in3, reg_write_ch17, reg_write_ch18);
  or inst70 (reg_write, reg_write_in1, reg_write_in2, reg_write_in3);

  // Other names for the same wires on the sheet: A_en = en_A; a_en_ch9 = sel_inA; alu_opcode_b0 = OpCode_ALU[0];
  //   alu_opcode_b1 = OpCode_ALU[1]; alu_opcode_b2 = OpCode_ALU[2]; alu_out_en = en_ALUOut; b_en = en_B;
  //   ex_mode_b0 = Extension_Mode[0]; ex_mode_b1 = Extension_Mode[1]; mdr_h_en = en_MDR_h; mdr_l_en = en_MDR_l;
  //   sel_alu_in1 = sel_ALUin1; sel_alu_in2_b0 = sel_ALUin2[0]; sel_alu_in2_b1 = sel_ALUin2[1]; sel_in_b = sel_inB;
  //   sel_mem_addr_b0 = sel_mem_address[0]; sel_mem_addr_b1 = sel_mem_address[1];
  //   sel_mem_write_data = sel_memWrite_data; sel_reg_write = sel_regWrite;
  //   sel_reg_write_data_b0 = sel_regWrite_data[0]; sel_reg_write_data_b1 = sel_regWrite_data[1];
  //   sel_reg_write_data_b2 = sel_regWrite_data[2]; t[3:1] = {PC_increase, en_IR_l, en_IR_h}
endmodule
